# Altium schematic sheet sensors.SchDoc
size A; SheetNumber: 3; SheetTotal: 4
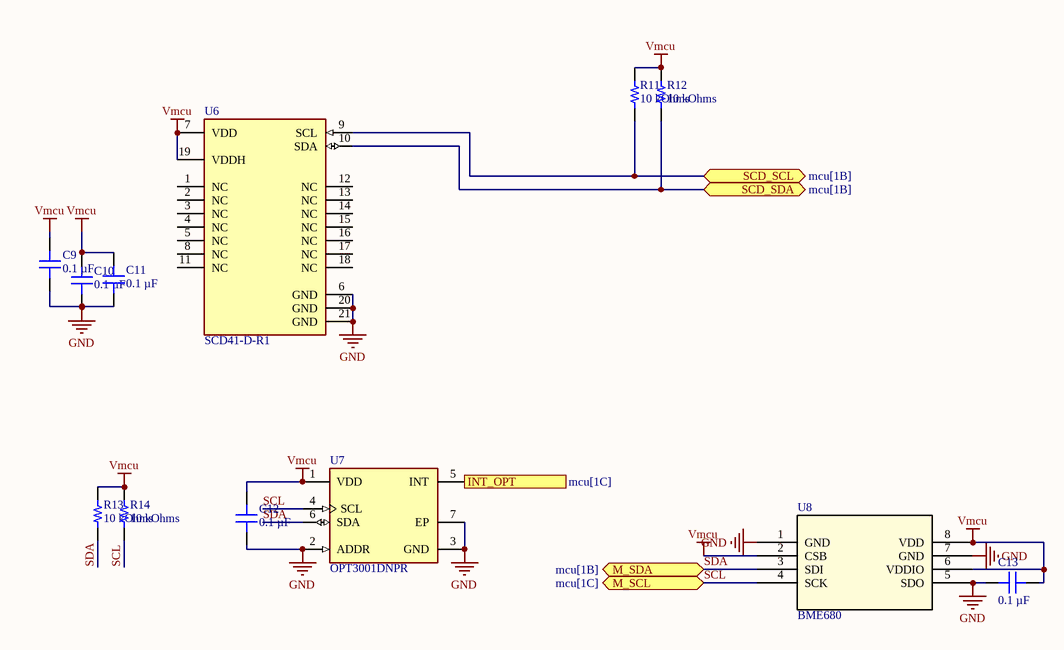
[diagram p0: sensors.SchDoc]

## Parts
C9  0.1 µF  [CAP 0402_1005]
C10  0.1 µF  [CAP 0402_1005]
C11  0.1 µF  [CAP 0402_1005]
C12  0.1 µF  [CAP 0402_1005]
C13  0.1 µF  [CAP 0402_1005]
R11  10 kOhms  [RES 0402_1005]
R12  10 kOhms  [RES 0402_1005]
R13  10 kOhms  [RES 0402_1005]
R14  10 kOhms  [RES 0402_1005]
U6  SCD41-D-R1  [FP-SCD41-D-R1-MFG]
U7  OPT3001DNPR  [FP-DNP0006A-MFG]
U8  BME680  [LGA8_BME680_BOS]

## Ports
INT_OPT (out, see mcu[1C]), M_SCL (bidir, see mcu[1C]), M_SDA (bidir, see mcu[1B]), SCD_SCL (bidir, see mcu[1B]), SCD_SDA (bidir, see mcu[1B])

## Nets
GND: C9.1 C10.1 C11.1 C12.1 C13.2 U6.6(GND) U6.20(GND) U6.21(GND) U7.2(ADDR) U7.3(GND) U7.7(EP) U8.1(GND) U8.5(SDO) U8.7(GND)
Vmcu: C9.2 C10.2 C11.2 C12.2 C13.1 R11.1 R12.1 R13.1 R14.1 U6.7(VDD) U6.19(VDDH) U7.1(VDD) U8.2(CSB) U8.6(VDDIO) U8.8(VDD)
INT_OPT: U7.5(INT) ; port INT_OPT
SCD_SCL: R11.2 U6.9(SCL) ; port SCD_SCL
SCD_SDA: R12.2 U6.10(SDA) ; port SCD_SDA
SCL: R14.2 U7.4(SCL) U8.4(SCK) ; port M_SCL
SDA: R13.2 U7.6(SDA) U8.3(SDI) ; port M_SDA

Not connected (* = marked no-connect by the designer): U6 1(NC) 2(NC) 3(NC) 4(NC) 5(NC) 8(NC) 11(NC) 12(NC) 13(NC) 14(NC) 15(NC) 16(NC) 17(NC) 18(NC)

## Library data of the parts
C9-C13 = C0402C104K7PAC7867: CAP CER 0.1UF 4V X5R 0402; manufacturer: KEMET; Tolerance: ±10%; Part Number: C0402C104K7PAC7867; Value: 0.1 µF; Applications: Bypass, Decoupling; Capacitance: 0.1 µF; componentlink1description: Datasheet; componentlink1url: https://api.kemet.com/component-edge/download/datasheet/C0402C104K7PAC7867.pdf; componentlink2description: DigiKey Link; componentlink2url: https://www.digikey.com/en/products/detail/kemet/C0402C104K7PAC7867/7381987; Device Package: 0402 (1005 Metric); lastupdated: 1/9/2022 12:30:40 pm; Lifecycle Status: Active; Minimum Order: 1; Mounting Type: Surface Mount, MLCC; Operating Temperature: -55°C ~ 85°C; Package / Case: 0402 (1005 Metric); packaging: TapeAndReel; partid: 5603; Part Status: Active; price: 0.01; series: SMD Comm X5R; Size / Dimension: 0.039" L x 0.020" W (1.00mm x 0.50mm); Supplier 1: DigiKey; Supplier Part Number 1: 399-14871-1-ND; Temperature Coefficient: X5R; Thickness (Max): 0.022" (0.55mm); Voltage - Rated: 4V
R11-R14 = RP73PF1E10KBTD: RES 10K OHM 0.1% 1/10W 0402; Manufacturer: TE Connectivity Passive Product; Power (Watts): 0.1W, 1/10W; Temperature Coefficient: ±25ppm/°C; Part Number: RP73PF1E10KBTD; Value: 10 kOhms; ComponentLink1Description: Datasheet; ComponentLink1URL: https://www.te.com/commerce/DocumentDelivery/DDEController?Action=srchrtrv&DocNm=1773272&DocType=DS&DocLang=English; ComponentLink2Description: DigiKey Link; ComponentLink2URL: https://www.digikey.com/en/products/detail/te-connectivity-passive-product/RP73PF1E10KBTD/8260957; Composition: Thin Film; Device Package: 0402 (1005 Metric); Height - Seated (Max): 0.014" (0.35mm); LastUpdated: 1/9/2022 12:46:57 pm; Lifecycle Status: Active; Minimum Order: 1; Number of Terminations: 2; Operating Temperature: -55°C ~ 155°C; Package / Case: 0402 (1005 Metric); Packaging: TapeAndReel; PartId: 2434; Part Status: Active; Price: 0.09; Resistance: 10 kOhms; Series: RP73, Holsworthy; Size / Dimension: 0.039" L x 0.020" W (1.00mm x 0.50mm); Supplier 1: DigiKey; Supplier Part Number 1: A127415CT-ND; Supplier Device Package: 0402; Tolerance: ±0.1%
U6 = CMP-144026-000007-1: CO2 SENSOR 40 PPM I2C SMD
U7 = CMP-04942-000002-1: SENSOR OPT 550NM AMBIENT 6USON; Manufacturer: Texas Instruments; Max Junction Temp: +150°C; Operating Supply Current: 0.3-1.8uA; Sensor Output: I2C,SMBus; Max Supply Voltage: 3.6V; Min Supply Voltage: 1.6V; Standoff Height: 0mm; Package: DNP0006A; Device Class L2: Optical Sensors; Temperature Range Low: -40°C; Digikey Description: SENSOR OPT 550NM AMBIENT 6USON; Automotive: No; Category: IC; Manufacturer Part Number: OPT3001DNPR; RoHS: TRUE; ComponentLink2URL: http://www.ti.com/lit/ds/symlink/opt3001.pdf; Lead Free: Yes; Octopart: https://octopart.com/opt3001dnpr-texas+instruments-47324050; Device Class L3: unset; ComponentLink2Description: Datasheet; Device Class L1: Sensors; Temperature Range High: +85°C; Temperature: -40°C to +85°C; Height: 0.65mm; Ipc Land Pattern Name: DFN200X200X60-6
U8 = BME680: No Description Available; Mfr_Name: Bosch Sensortec; RefDes: RefDes; Type: Type